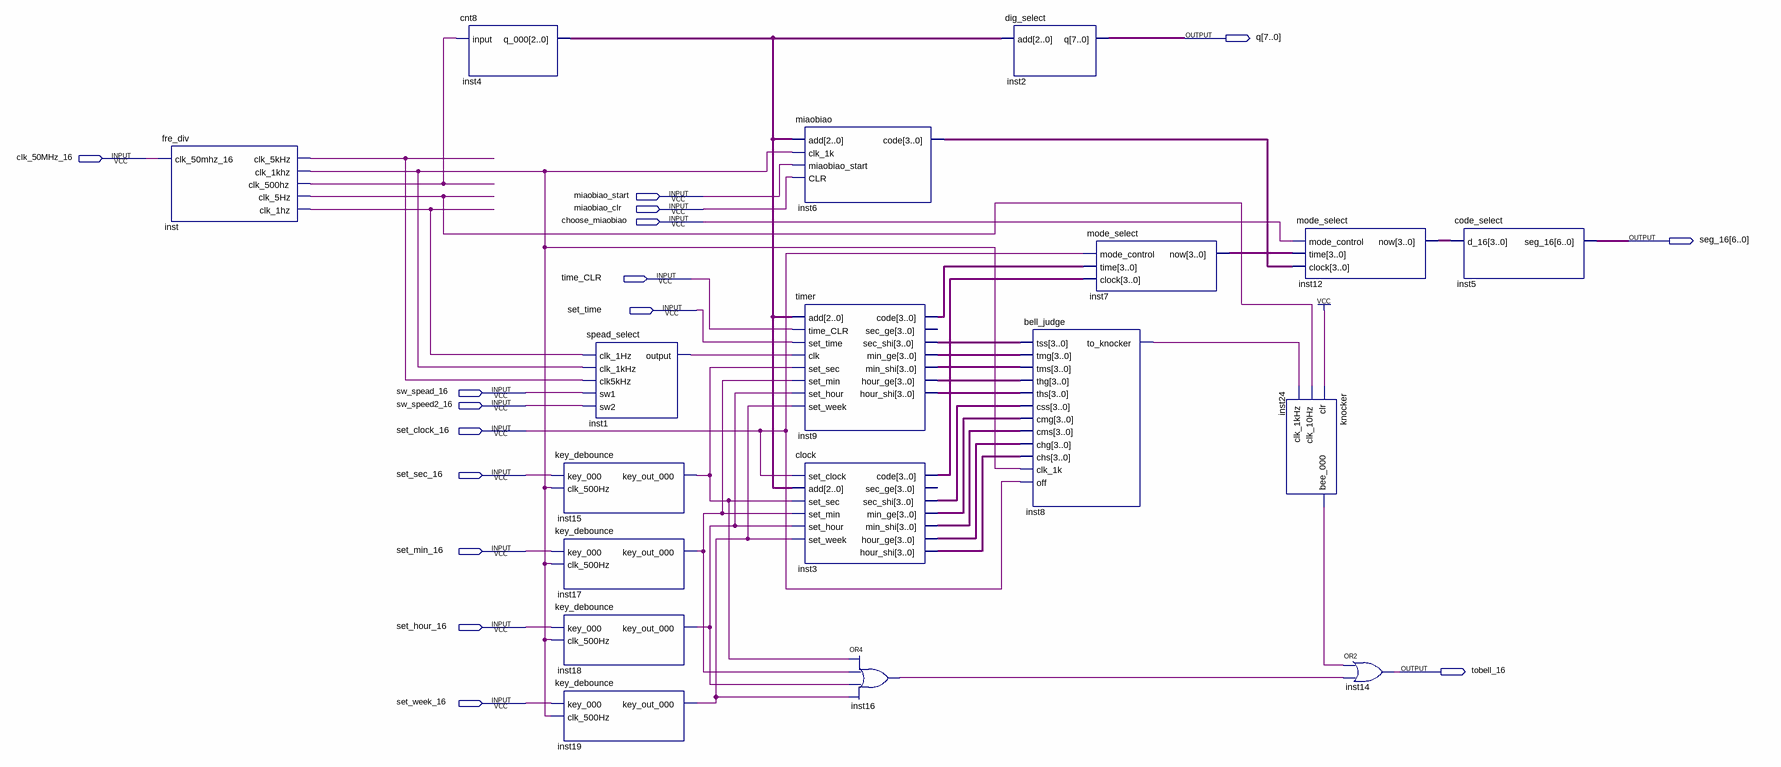
[diagram p0: schematic sheet]
// Quartus schematic digital_clock.bdf as structural Verilog: 18 symbols, 16 pins
module digital_clock (
  input  clk_50MHz_16,
  input  miaobiao_start,
  input  miaobiao_clr,
  input  choose_miaobiao,
  input  time_CLR,
  input  set_time,
  input  sw_spead_16,
  input  sw_speed2_16,
  input  set_clock_16,
  input  set_sec_16,
  input  set_min_16,
  input  set_hour_16,
  input  set_week_16,
  output [7:0] q,
  output [6:0] seg_16,
  output tobell_16
);

  wire inst1_output, inst8_to_knocker, inst15_key_out_000, inst16_out, inst17_key_out_000,
       inst18_key_out_000, inst19_key_out_000, inst24_bee_000, inst_clk_1hz, inst_clk_1khz, inst_clk_5hz,
       inst_clk_5khz, inst_clk_500hz;
  wire [2:0] inst4_q_000;
  wire [3:0] inst3_code, inst3_hour_ge, inst3_hour_shi, inst3_min_ge, inst3_min_shi, inst3_sec_shi,
       inst6_code, inst7_now, inst9_code, inst9_hour_ge, inst9_hour_shi, inst9_min_ge, inst9_min_shi,
       inst9_sec_shi, inst12_now;

  fre_div inst (
    .clk_50mhz_16(clk_50MHz_16), .clk_5kHz(inst_clk_5khz), .clk_1khz(inst_clk_1khz),
    .clk_500hz(inst_clk_500hz), .clk_5Hz(inst_clk_5hz), .clk_1hz(inst_clk_1hz));
  cnt8 inst4 (.\input (inst_clk_500hz), .q_000(inst4_q_000));
  spead_select inst1 (
    .clk_1Hz(inst_clk_1hz), .clk_1kHz(inst_clk_1khz), .clk5kHz(inst_clk_5khz), .sw1(sw_spead_16),
    .sw2(sw_speed2_16), .\output (inst1_output));
  key_debounce inst15 (.key_000(set_sec_16), .clk_500Hz(inst_clk_1khz), .key_out_000(inst15_key_out_000));
  key_debounce inst17 (.key_000(set_min_16), .clk_500Hz(inst_clk_1khz), .key_out_000(inst17_key_out_000));
  key_debounce inst18 (.key_000(set_hour_16), .clk_500Hz(inst_clk_1khz), .key_out_000(inst18_key_out_000));
  key_debounce inst19 (.key_000(set_week_16), .clk_500Hz(inst_clk_1khz), .key_out_000(inst19_key_out_000));
  miaobiao inst6 (
    .add(inst4_q_000), .clk_1k(inst_clk_1khz), .miaobiao_start(miaobiao_start), .CLR(miaobiao_clr),
    .code(inst6_code));
  timer inst9 (
    .add(inst4_q_000), .time_CLR(time_CLR), .set_time(set_time), .clk(inst1_output),
    .set_sec(inst15_key_out_000), .set_min(inst17_key_out_000), .set_hour(inst18_key_out_000),
    .set_week(inst19_key_out_000), .code(inst9_code), .sec_shi(inst9_sec_shi), .min_ge(inst9_min_ge),
    .min_shi(inst9_min_shi), .hour_ge(inst9_hour_ge), .hour_shi(inst9_hour_shi));  // open: sec_ge
  clock inst3 (
    .set_clock(set_clock_16), .add(inst4_q_000), .set_sec(inst15_key_out_000), .set_min(inst17_key_out_000),
    .set_hour(inst18_key_out_000), .set_week(inst19_key_out_000), .code(inst3_code), .sec_shi(inst3_sec_shi),
    .min_ge(inst3_min_ge), .min_shi(inst3_min_shi), .hour_ge(inst3_hour_ge), .hour_shi(inst3_hour_shi));  // open: sec_ge
  or inst16 (inst16_out, inst15_key_out_000, inst17_key_out_000, inst18_key_out_000, inst19_key_out_000);
  dig_select inst2 (.add(inst4_q_000), .q(q));
  bell_judge inst8 (
    .tss(inst9_sec_shi), .tmg(inst9_min_ge), .tms(inst9_min_shi), .thg(inst9_hour_ge), .ths(inst9_hour_shi),
    .css(inst3_sec_shi), .cmg(inst3_min_ge), .cms(inst3_min_shi), .chg(inst3_hour_ge), .chs(inst3_hour_shi),
    .clk_1k(inst_clk_1khz), .off(set_clock_16), .to_knocker(inst8_to_knocker));
  mode_select inst7 (.mode_control(set_clock_16), .\time (inst9_code), .clock(inst3_code), .now(inst7_now));
  mode_select inst12 (.mode_control(choose_miaobiao), .\time (inst7_now), .clock(inst6_code), .now(inst12_now));
  knocker inst24 (.clr(1'b1), .clk_10Hz(inst_clk_5hz), .clk_1kHz(inst8_to_knocker), .bee_000(inst24_bee_000));
  or inst14 (tobell_16, inst24_bee_000, inst16_out);
  code_select inst5 (.d_16(inst12_now), .seg_16(seg_16));
endmodule
